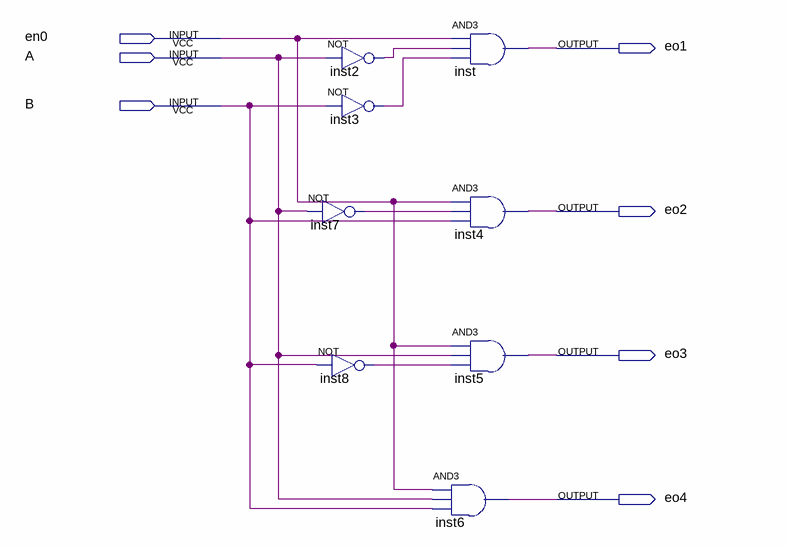
[diagram p0: schematic sheet]
// Quartus schematic NewEnable.bdf as structural Verilog: 8 symbols, 7 pins
module NewEnable (
  input  en0,
  input  A,
  input  B,
  output eo1,
  output eo2,
  output eo3,
  output eo4
);

  wire inst2_out, inst3_out, inst7_out, inst8_out;

  not inst2 (inst2_out, A);
  not inst3 (inst3_out, B);
  not inst7 (inst7_out, A);
  not inst8 (inst8_out, B);
  and inst (eo1, en0, inst2_out, inst3_out);
  and inst4 (eo2, en0, inst7_out, B);
  and inst5 (eo3, en0, A, inst8_out);
  and inst6 (eo4, en0, A, B);
endmodule
